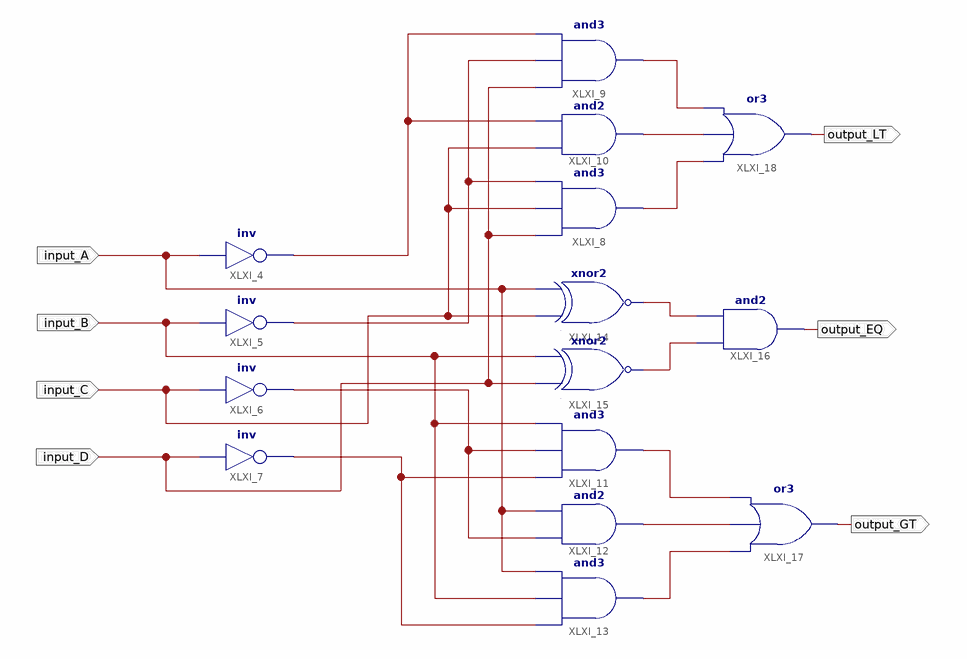
[diagram p0: schematic sheet 1]
// Xilinx ISE schematic comparator.sch (spartan3a) as structural Verilog: 15 symbols, 7 ports
module comparator (
  input  input_A,
  input  input_B,
  input  input_C,
  input  input_D,
  output output_EQ,
  output output_GT,
  output output_LT
);

  wire XLXN_21, XLXN_22, XLXN_23, XLXN_24, XLXN_25, XLXN_27, XLXN_28, XLXN_29, XLXN_30, XLXN_31, XLXN_32,
       XLXN_33;

  not XLXI_4 (XLXN_25, input_A);
  not XLXI_5 (XLXN_27, input_B);
  not XLXI_6 (XLXN_23, input_C);
  not XLXI_7 (XLXN_24, input_D);
  and XLXI_8 (XLXN_32, input_D, input_C, XLXN_27);
  and XLXI_9 (XLXN_33, input_D, XLXN_27, XLXN_25);
  and XLXI_10 (XLXN_31, input_C, XLXN_25);
  and XLXI_11 (XLXN_30, XLXN_24, XLXN_23, input_B);
  and XLXI_12 (XLXN_28, XLXN_23, input_A);
  and XLXI_13 (XLXN_29, XLXN_24, input_B, input_A);
  xnor XLXI_14 (XLXN_21, input_C, input_A);
  xnor XLXI_15 (XLXN_22, input_D, input_B);
  and XLXI_16 (output_EQ, XLXN_22, XLXN_21);
  or XLXI_17 (output_GT, XLXN_29, XLXN_28, XLXN_30);
  or XLXI_18 (output_LT, XLXN_32, XLXN_31, XLXN_33);
endmodule
